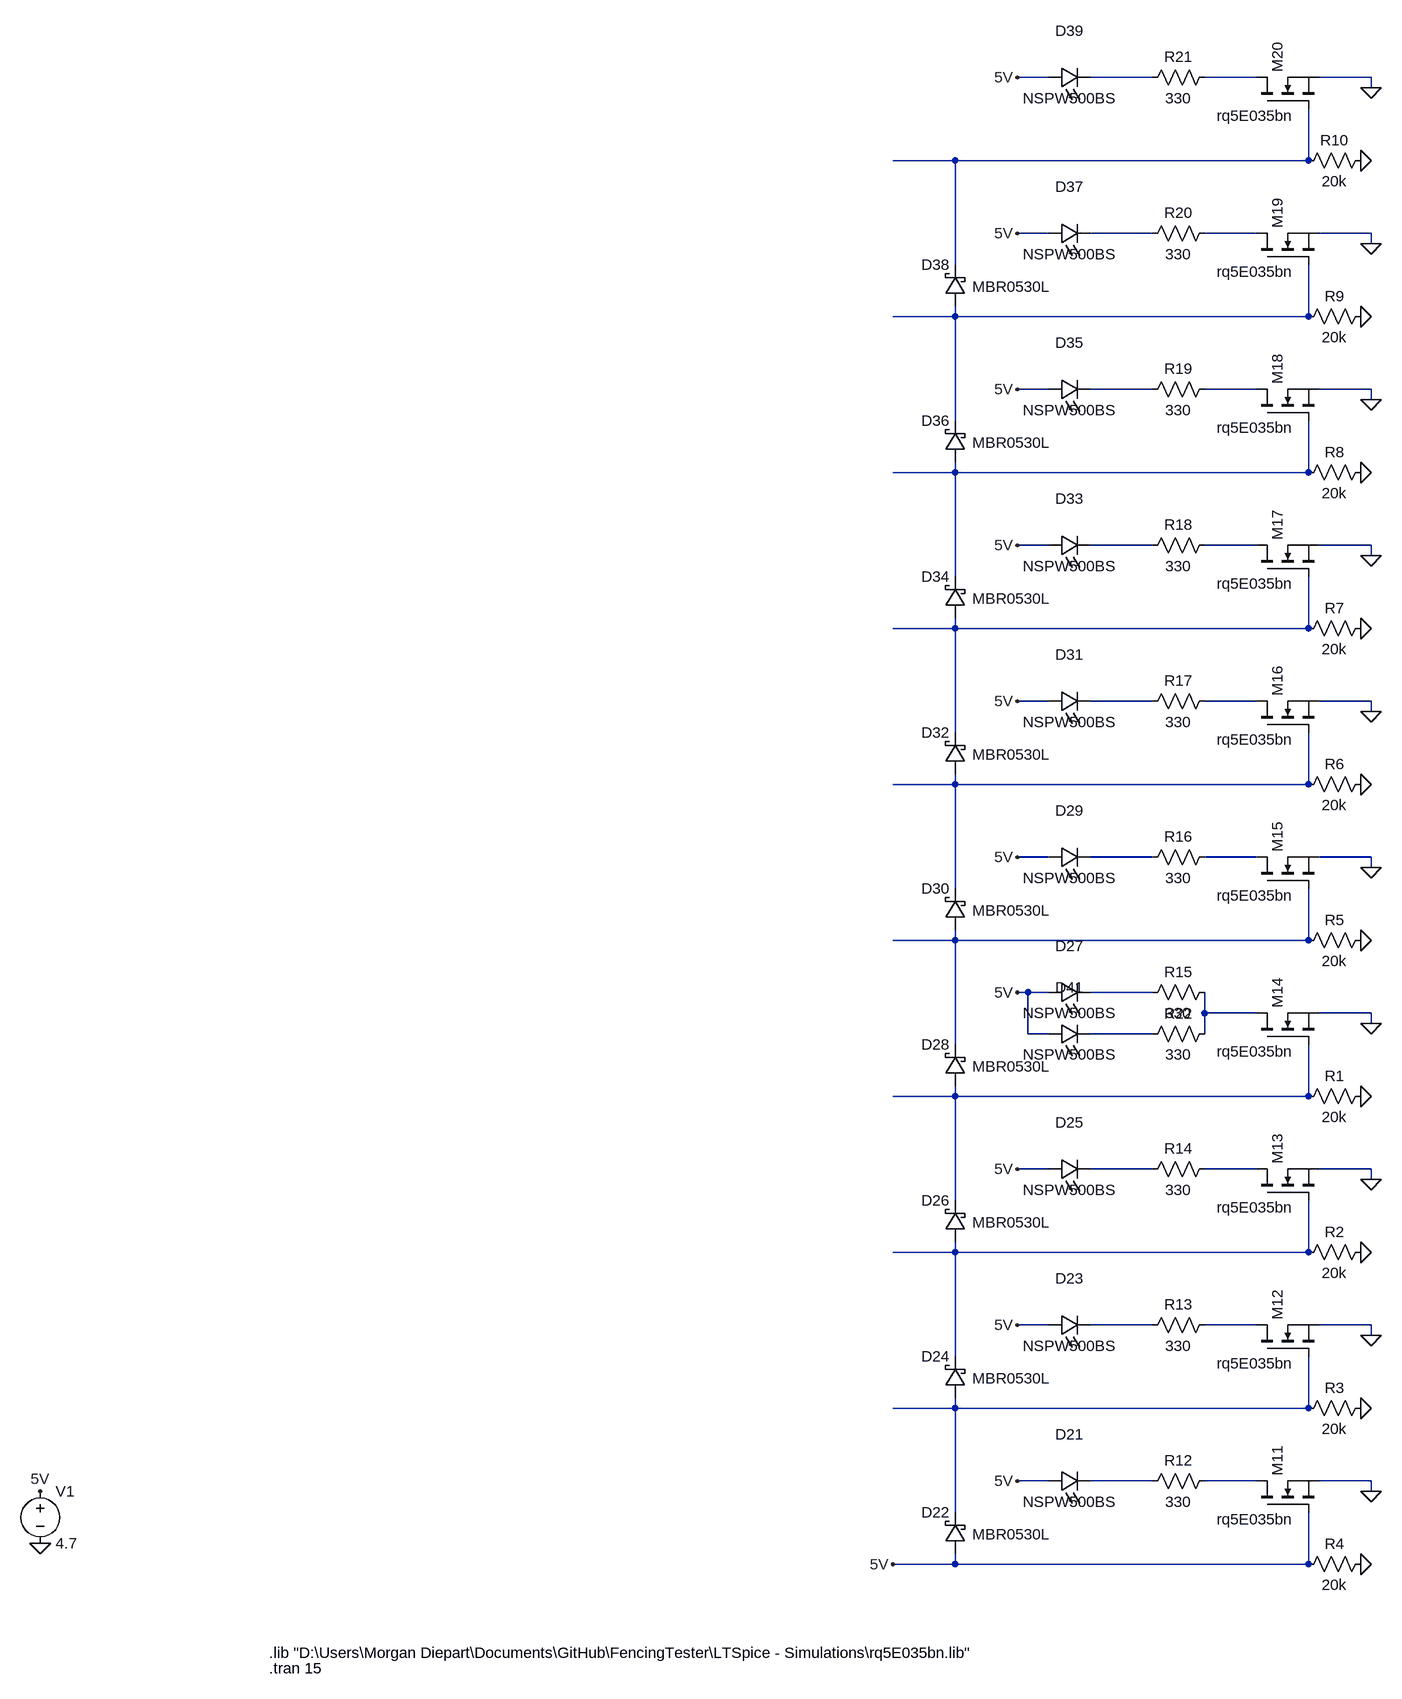
[diagram p0: schematic bargraph-mosfet.asc]
bargraph-mosfet.asc, the LTspice schematic file:
Version 4
SHEET 1 1828 680
WIRE 1312 -2144 1264 -2144
WIRE 1472 -2144 1376 -2144
WIRE 1632 -2144 1552 -2144
WIRE 1808 -2144 1728 -2144
WIRE 1808 -2128 1808 -2144
WIRE 1168 -2016 1072 -2016
WIRE 1712 -2016 1712 -2096
WIRE 1712 -2016 1168 -2016
WIRE 1312 -1904 1264 -1904
WIRE 1472 -1904 1376 -1904
WIRE 1632 -1904 1552 -1904
WIRE 1808 -1904 1728 -1904
WIRE 1808 -1888 1808 -1904
WIRE 1168 -1856 1168 -2016
WIRE 1168 -1776 1168 -1792
WIRE 1168 -1776 1072 -1776
WIRE 1712 -1776 1712 -1856
WIRE 1712 -1776 1168 -1776
WIRE 1312 -1664 1264 -1664
WIRE 1472 -1664 1376 -1664
WIRE 1632 -1664 1552 -1664
WIRE 1808 -1664 1728 -1664
WIRE 1808 -1648 1808 -1664
WIRE 1168 -1616 1168 -1776
WIRE 1168 -1536 1168 -1552
WIRE 1168 -1536 1072 -1536
WIRE 1712 -1536 1712 -1616
WIRE 1712 -1536 1168 -1536
WIRE 1312 -1424 1264 -1424
WIRE 1472 -1424 1376 -1424
WIRE 1632 -1424 1552 -1424
WIRE 1808 -1424 1728 -1424
WIRE 1808 -1408 1808 -1424
WIRE 1168 -1376 1168 -1536
WIRE 1168 -1296 1168 -1312
WIRE 1168 -1296 1072 -1296
WIRE 1712 -1296 1712 -1376
WIRE 1712 -1296 1168 -1296
WIRE 1312 -1184 1264 -1184
WIRE 1472 -1184 1376 -1184
WIRE 1632 -1184 1552 -1184
WIRE 1808 -1184 1728 -1184
WIRE 1808 -1168 1808 -1184
WIRE 1168 -1136 1168 -1296
WIRE 1168 -1056 1168 -1072
WIRE 1168 -1056 1072 -1056
WIRE 1712 -1056 1712 -1136
WIRE 1712 -1056 1168 -1056
WIRE 1312 -944 1264 -944
WIRE 1472 -944 1376 -944
WIRE 1632 -944 1552 -944
WIRE 1808 -944 1728 -944
WIRE 1808 -928 1808 -944
WIRE 1168 -896 1168 -1056
WIRE 1168 -816 1168 -832
WIRE 1168 -816 1072 -816
WIRE 1712 -816 1712 -896
WIRE 1712 -816 1168 -816
WIRE 1280 -736 1264 -736
WIRE 1312 -736 1280 -736
WIRE 1472 -736 1376 -736
WIRE 1552 -704 1552 -736
WIRE 1632 -704 1552 -704
WIRE 1808 -704 1728 -704
WIRE 1808 -688 1808 -704
WIRE 1280 -672 1280 -736
WIRE 1312 -672 1280 -672
WIRE 1472 -672 1376 -672
WIRE 1552 -672 1552 -704
WIRE 1168 -656 1168 -816
WIRE 1168 -576 1168 -592
WIRE 1168 -576 1072 -576
WIRE 1712 -576 1712 -656
WIRE 1712 -576 1168 -576
WIRE 1312 -464 1264 -464
WIRE 1472 -464 1376 -464
WIRE 1632 -464 1552 -464
WIRE 1808 -464 1728 -464
WIRE 1808 -448 1808 -464
WIRE 1168 -416 1168 -576
WIRE 1168 -336 1168 -352
WIRE 1168 -336 1072 -336
WIRE 1712 -336 1712 -416
WIRE 1712 -336 1168 -336
WIRE 1312 -224 1264 -224
WIRE 1472 -224 1376 -224
WIRE 1632 -224 1552 -224
WIRE 1808 -224 1728 -224
WIRE 1808 -208 1808 -224
WIRE 1168 -176 1168 -336
WIRE 1168 -96 1168 -112
WIRE 1168 -96 1072 -96
WIRE 1712 -96 1712 -176
WIRE 1712 -96 1168 -96
WIRE 1312 16 1264 16
WIRE 1472 16 1376 16
WIRE 1632 16 1552 16
WIRE 1808 16 1728 16
WIRE 1808 32 1808 16
WIRE 1168 64 1168 -96
WIRE 1168 144 1168 128
WIRE 1168 144 1072 144
WIRE 1712 144 1712 64
WIRE 1712 144 1168 144
FLAG -240 32 5V
FLAG -240 112 0
FLAG 1264 16 5V
FLAG 1808 32 0
FLAG 1264 -224 5V
FLAG 1808 -208 0
FLAG 1264 -464 5V
FLAG 1808 -448 0
FLAG 1264 -736 5V
FLAG 1808 -688 0
FLAG 1264 -944 5V
FLAG 1808 -928 0
FLAG 1264 -1184 5V
FLAG 1808 -1168 0
FLAG 1264 -1424 5V
FLAG 1808 -1408 0
FLAG 1264 -1664 5V
FLAG 1808 -1648 0
FLAG 1264 -1904 5V
FLAG 1808 -1888 0
FLAG 1264 -2144 5V
FLAG 1808 -2128 0
FLAG 1072 144 5V
FLAG 1792 -2016 0
FLAG 1792 -1776 0
FLAG 1792 -1536 0
FLAG 1792 -1296 0
FLAG 1792 -1056 0
FLAG 1792 -816 0
FLAG 1792 -576 0
FLAG 1792 -336 0
FLAG 1792 -96 0
FLAG 1792 144 0
SYMBOL voltage -240 16 R0
WINDOW 123 0 0 Left 0
WINDOW 39 0 0 Left 0
SYMATTR InstName V1
SYMATTR Value 4.7
SYMBOL nmos 1632 64 R270
WINDOW 3 -11 -61 VRight 2
SYMATTR Value rq5E035bn
SYMATTR InstName M11
SYMATTR Prefix X
SYMBOL res 1568 0 R90
WINDOW 0 0 56 VBottom 2
WINDOW 3 32 56 VTop 2
SYMATTR InstName R12
SYMATTR Value 330
SYMBOL LED 1312 32 R270
WINDOW 0 72 32 VTop 2
WINDOW 3 0 32 VBottom 2
SYMATTR InstName D21
SYMATTR Value NSPW500BS
SYMBOL schottky 1184 128 R180
WINDOW 0 24 64 Left 2
WINDOW 3 -131 30 Left 2
SYMATTR InstName D22
SYMATTR Value MBR0530L
SYMATTR Description Diode
SYMATTR Type diode
SYMBOL nmos 1632 -176 R270
WINDOW 3 -11 -61 VRight 2
SYMATTR Value rq5E035bn
SYMATTR InstName M12
SYMATTR Prefix X
SYMBOL res 1568 -240 R90
WINDOW 0 0 56 VBottom 2
WINDOW 3 32 56 VTop 2
SYMATTR InstName R13
SYMATTR Value 330
SYMBOL LED 1312 -208 R270
WINDOW 0 72 32 VTop 2
WINDOW 3 0 32 VBottom 2
SYMATTR InstName D23
SYMATTR Value NSPW500BS
SYMBOL schottky 1184 -112 R180
WINDOW 0 24 64 Left 2
WINDOW 3 -131 30 Left 2
SYMATTR InstName D24
SYMATTR Value MBR0530L
SYMATTR Description Diode
SYMATTR Type diode
SYMBOL nmos 1632 -416 R270
WINDOW 3 -11 -61 VRight 2
SYMATTR Value rq5E035bn
SYMATTR InstName M13
SYMATTR Prefix X
SYMBOL res 1568 -480 R90
WINDOW 0 0 56 VBottom 2
WINDOW 3 32 56 VTop 2
SYMATTR InstName R14
SYMATTR Value 330
SYMBOL LED 1312 -448 R270
WINDOW 0 72 32 VTop 2
WINDOW 3 0 32 VBottom 2
SYMATTR InstName D25
SYMATTR Value NSPW500BS
SYMBOL schottky 1184 -352 R180
WINDOW 0 24 64 Left 2
WINDOW 3 -131 30 Left 2
SYMATTR InstName D26
SYMATTR Value MBR0530L
SYMATTR Description Diode
SYMATTR Type diode
SYMBOL nmos 1632 -656 R270
WINDOW 3 -11 -61 VRight 2
SYMATTR Value rq5E035bn
SYMATTR InstName M14
SYMATTR Prefix X
SYMBOL res 1568 -752 R90
WINDOW 0 0 56 VBottom 2
WINDOW 3 32 56 VTop 2
SYMATTR InstName R15
SYMATTR Value 330
SYMBOL LED 1312 -720 R270
WINDOW 0 72 32 VTop 2
WINDOW 3 0 32 VBottom 2
SYMATTR InstName D27
SYMATTR Value NSPW500BS
SYMBOL schottky 1184 -592 R180
WINDOW 0 24 64 Left 2
WINDOW 3 -131 30 Left 2
SYMATTR InstName D28
SYMATTR Value MBR0530L
SYMATTR Description Diode
SYMATTR Type diode
SYMBOL nmos 1632 -896 R270
WINDOW 3 -11 -61 VRight 2
SYMATTR Value rq5E035bn
SYMATTR InstName M15
SYMATTR Prefix X
SYMBOL res 1568 -960 R90
WINDOW 0 0 56 VBottom 2
WINDOW 3 32 56 VTop 2
SYMATTR InstName R16
SYMATTR Value 330
SYMBOL LED 1312 -928 R270
WINDOW 0 72 32 VTop 2
WINDOW 3 0 32 VBottom 2
SYMATTR InstName D29
SYMATTR Value NSPW500BS
SYMBOL schottky 1184 -832 R180
WINDOW 0 24 64 Left 2
WINDOW 3 -131 30 Left 2
SYMATTR InstName D30
SYMATTR Value MBR0530L
SYMATTR Description Diode
SYMATTR Type diode
SYMBOL nmos 1632 -1136 R270
WINDOW 3 -11 -61 VRight 2
SYMATTR Value rq5E035bn
SYMATTR InstName M16
SYMATTR Prefix X
SYMBOL res 1568 -1200 R90
WINDOW 0 0 56 VBottom 2
WINDOW 3 32 56 VTop 2
SYMATTR InstName R17
SYMATTR Value 330
SYMBOL LED 1312 -1168 R270
WINDOW 0 72 32 VTop 2
WINDOW 3 0 32 VBottom 2
SYMATTR InstName D31
SYMATTR Value NSPW500BS
SYMBOL schottky 1184 -1072 R180
WINDOW 0 24 64 Left 2
WINDOW 3 -131 30 Left 2
SYMATTR InstName D32
SYMATTR Value MBR0530L
SYMATTR Description Diode
SYMATTR Type diode
SYMBOL nmos 1632 -1376 R270
WINDOW 3 -11 -61 VRight 2
SYMATTR Value rq5E035bn
SYMATTR InstName M17
SYMATTR Prefix X
SYMBOL res 1568 -1440 R90
WINDOW 0 0 56 VBottom 2
WINDOW 3 32 56 VTop 2
SYMATTR InstName R18
SYMATTR Value 330
SYMBOL LED 1312 -1408 R270
WINDOW 0 72 32 VTop 2
WINDOW 3 0 32 VBottom 2
SYMATTR InstName D33
SYMATTR Value NSPW500BS
SYMBOL schottky 1184 -1312 R180
WINDOW 0 24 64 Left 2
WINDOW 3 -131 30 Left 2
SYMATTR InstName D34
SYMATTR Value MBR0530L
SYMATTR Description Diode
SYMATTR Type diode
SYMBOL nmos 1632 -1616 R270
WINDOW 3 -11 -61 VRight 2
SYMATTR Value rq5E035bn
SYMATTR InstName M18
SYMATTR Prefix X
SYMBOL res 1568 -1680 R90
WINDOW 0 0 56 VBottom 2
WINDOW 3 32 56 VTop 2
SYMATTR InstName R19
SYMATTR Value 330
SYMBOL LED 1312 -1648 R270
WINDOW 0 72 32 VTop 2
WINDOW 3 0 32 VBottom 2
SYMATTR InstName D35
SYMATTR Value NSPW500BS
SYMBOL schottky 1184 -1552 R180
WINDOW 0 24 64 Left 2
WINDOW 3 -131 30 Left 2
SYMATTR InstName D36
SYMATTR Value MBR0530L
SYMATTR Description Diode
SYMATTR Type diode
SYMBOL nmos 1632 -1856 R270
WINDOW 3 -11 -61 VRight 2
SYMATTR Value rq5E035bn
SYMATTR InstName M19
SYMATTR Prefix X
SYMBOL res 1568 -1920 R90
WINDOW 0 0 56 VBottom 2
WINDOW 3 32 56 VTop 2
SYMATTR InstName R20
SYMATTR Value 330
SYMBOL LED 1312 -1888 R270
WINDOW 0 72 32 VTop 2
WINDOW 3 0 32 VBottom 2
SYMATTR InstName D37
SYMATTR Value NSPW500BS
SYMBOL schottky 1184 -1792 R180
WINDOW 0 24 64 Left 2
WINDOW 3 -131 30 Left 2
SYMATTR InstName D38
SYMATTR Value MBR0530L
SYMATTR Description Diode
SYMATTR Type diode
SYMBOL nmos 1632 -2096 R270
WINDOW 3 -11 -61 VRight 2
SYMATTR Value rq5E035bn
SYMATTR InstName M20
SYMATTR Prefix X
SYMBOL res 1568 -2160 R90
WINDOW 0 0 56 VBottom 2
WINDOW 3 32 56 VTop 2
SYMATTR InstName R21
SYMATTR Value 330
SYMBOL LED 1312 -2128 R270
WINDOW 0 72 32 VTop 2
WINDOW 3 0 32 VBottom 2
SYMATTR InstName D39
SYMATTR Value NSPW500BS
SYMBOL LED 1312 -656 R270
WINDOW 0 72 32 VTop 2
WINDOW 3 0 32 VBottom 2
SYMATTR InstName D41
SYMATTR Value NSPW500BS
SYMBOL res 1568 -688 R90
WINDOW 0 0 56 VBottom 2
WINDOW 3 32 56 VTop 2
SYMATTR InstName R22
SYMATTR Value 330
SYMBOL res 1808 -592 R90
WINDOW 0 0 56 VBottom 2
WINDOW 3 32 56 VTop 2
SYMATTR InstName R1
SYMATTR Value 20k
SYMBOL res 1808 -352 R90
WINDOW 0 0 56 VBottom 2
WINDOW 3 32 56 VTop 2
SYMATTR InstName R2
SYMATTR Value 20k
SYMBOL res 1808 -112 R90
WINDOW 0 0 56 VBottom 2
WINDOW 3 32 56 VTop 2
SYMATTR InstName R3
SYMATTR Value 20k
SYMBOL res 1808 128 R90
WINDOW 0 0 56 VBottom 2
WINDOW 3 32 56 VTop 2
SYMATTR InstName R4
SYMATTR Value 20k
SYMBOL res 1808 -832 R90
WINDOW 0 0 56 VBottom 2
WINDOW 3 32 56 VTop 2
SYMATTR InstName R5
SYMATTR Value 20k
SYMBOL res 1808 -1072 R90
WINDOW 0 0 56 VBottom 2
WINDOW 3 32 56 VTop 2
SYMATTR InstName R6
SYMATTR Value 20k
SYMBOL res 1808 -1312 R90
WINDOW 0 0 56 VBottom 2
WINDOW 3 32 56 VTop 2
SYMATTR InstName R7
SYMATTR Value 20k
SYMBOL res 1808 -1552 R90
WINDOW 0 0 56 VBottom 2
WINDOW 3 32 56 VTop 2
SYMATTR InstName R8
SYMATTR Value 20k
SYMBOL res 1808 -1792 R90
WINDOW 0 0 56 VBottom 2
WINDOW 3 32 56 VTop 2
SYMATTR InstName R9
SYMATTR Value 20k
SYMBOL res 1808 -2032 R90
WINDOW 0 0 56 VBottom 2
WINDOW 3 32 56 VTop 2
SYMATTR InstName R10
SYMATTR Value 20k
TEXT 112 280 Left 2 !.lib "D:\\Users\\Morgan Diepart\\Documents\\GitHub\\FencingTester\\LTSpice - Simulations\\rq5E035bn.lib"
TEXT 112 304 Left 2 !.tran 15

The netlist it stands for:
* bargraph-mosfet.asc
V1 5V 0 4.7
XM11 N030 5V 0 rq5E035bn  ; pins D G S
R12 N030 N029 330
D21 5V N029 NSPW500BS
D22 5V N028 MBR0530L
XM12 N027 N028 0 rq5E035bn  ; pins D G S
R13 N027 N026 330
D23 5V N026 NSPW500BS
D24 N028 N025 MBR0530L
XM13 N024 N025 0 rq5E035bn  ; pins D G S
R14 N024 N023 330
D25 5V N023 NSPW500BS
D26 N025 N022 MBR0530L
XM14 N020 N022 0 rq5E035bn  ; pins D G S
R15 N020 N019 330
D27 5V N019 NSPW500BS
D28 N022 N018 MBR0530L
XM15 N017 N018 0 rq5E035bn  ; pins D G S
R16 N017 N016 330
D29 5V N016 NSPW500BS
D30 N018 N015 MBR0530L
XM16 N014 N015 0 rq5E035bn  ; pins D G S
R17 N014 N013 330
D31 5V N013 NSPW500BS
D32 N015 N012 MBR0530L
XM17 N011 N012 0 rq5E035bn  ; pins D G S
R18 N011 N010 330
D33 5V N010 NSPW500BS
D34 N012 N009 MBR0530L
XM18 N008 N009 0 rq5E035bn  ; pins D G S
R19 N008 N007 330
D35 5V N007 NSPW500BS
D36 N009 N006 MBR0530L
XM19 N005 N006 0 rq5E035bn  ; pins D G S
R20 N005 N004 330
D37 5V N004 NSPW500BS
D38 N006 N003 MBR0530L
XM20 N002 N003 0 rq5E035bn  ; pins D G S
R21 N002 N001 330
D39 5V N001 NSPW500BS
D41 5V N021 NSPW500BS
R22 N020 N021 330
R1 0 N022 20k
R2 0 N025 20k
R3 0 N028 20k
R4 0 5V 20k
R5 0 N018 20k
R6 0 N015 20k
R7 0 N012 20k
R8 0 N009 20k
R9 0 N006 20k
R10 0 N003 20k
.model D D
.lib standard.dio
.lib "D:\Users\Morgan Diepart\Documents\GitHub\FencingTester\LTSpice - Simulations\rq5E035bn.lib"
.tran 15
.backanno
.end